# EAGLE design STM32F103C8T6 (EAGLE 9.4.2)
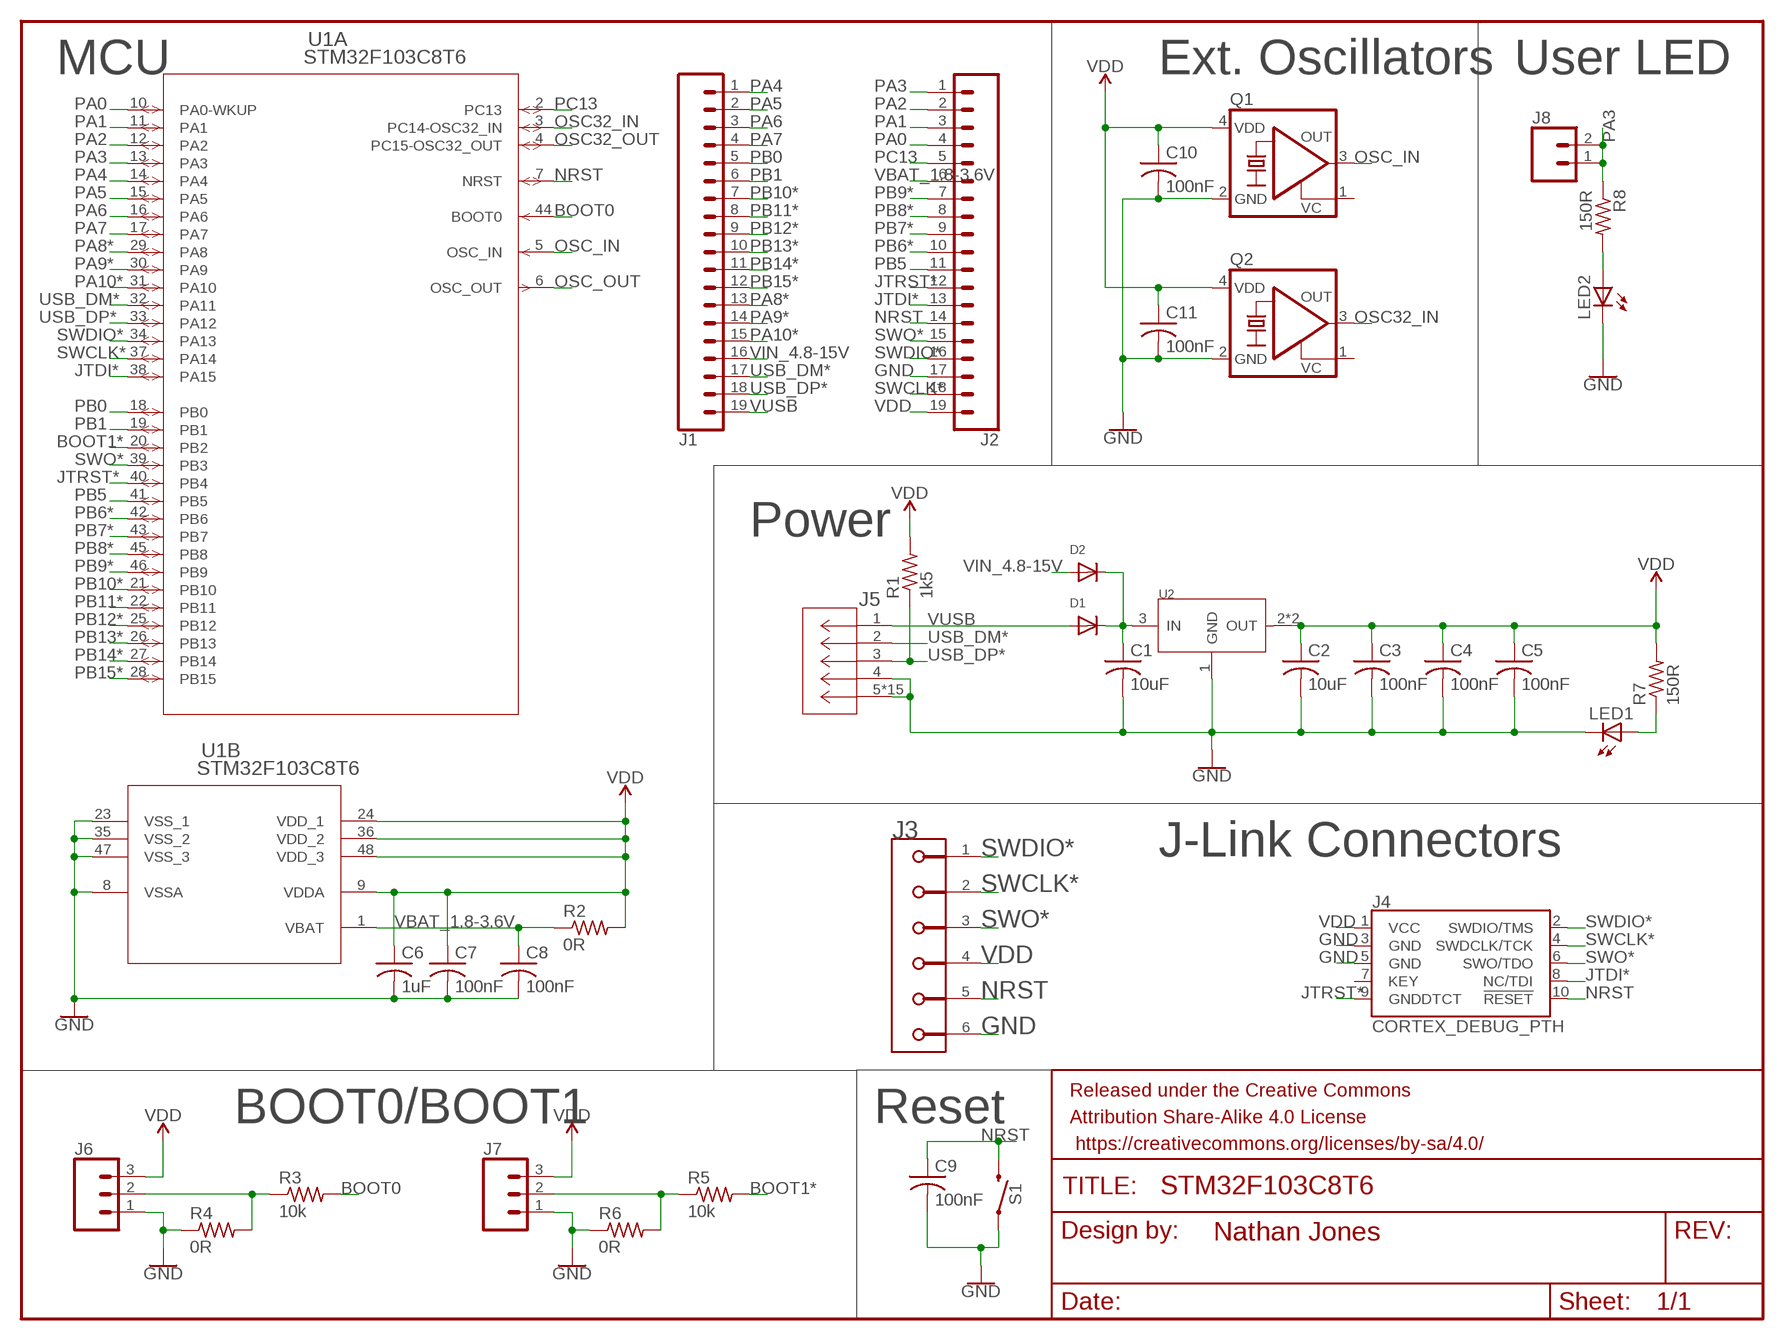
[diagram p0: schematic, sheet 1]

## Parts
C1  10uF  C-USC0402  [C0402]
C2  10uF  C-USC0402  [C0402]
C3  100nF  C-USC0402  [C0402]
C4  100nF  C-USC0402  [C0402]
C5  100nF  C-USC0402  [C0402]
C6  1uF  C-USC0402  [C0402]
C7  100nF  C-USC0402  [C0402]
C8  100nF  C-USC0402  [C0402]
C9  100nF  C-USC0402  [C0402]
C10  100nF  C-USC0402  [C0402]
C11  100nF  C-USC0402  [C0402]
D1  DIODESOD-123  [SOD-123]
D2  DIODESOD-123  [SOD-123]
FRAME2  FRAME-LETTERNO_PACKAGE  [DUMMY]
J1  CONN_191X19_NO_SILK  [1X19_NO_SILK]
J2  CONN_191X19_NO_SILK  [1X19_NO_SILK]
J3  AVX_6-PIN_009159006061916  [AVX_6-PIN_009159006061916_0]
J4  CORTEX_DEBUG_PTH  [2X5-PTH-1.27MM]
J5  10118194-0001LF  [CONN_10118194-0001LF_AMP]
J6  CONN_031X03_NO_SILK  [1X03_NO_SILK]
J7  CONN_031X03_NO_SILK  [1X03_NO_SILK]
J8  CONN_021X02_NO_SILK  [1X02_NO_SILK]
LED1  LEDCHIPLED_0603  [CHIPLED_0603]
LED2  LEDCHIPLED_0603  [CHIPLED_0603]
Q1  KXO-VCXO-CMOS_4  [3.2X2.5_KXO-84-TCXO]
Q2  KXO-VCXO-CMOS_4  [3.2X2.5_KXO-84-TCXO]
R1  1k5  R-US_R0402  [R0402]
R2  0R  R-US_R0402  [R0402]
R3  10k  R-US_R0402  [R0402]
R4  0R  R-US_R0402  [R0402]
R5  10k  R-US_R0402  [R0402]
R6  0R  R-US_R0402  [R0402]
R7  150R  R-US_R0402  [R0402]
R8  150R  R-US_R0402  [R0402]
S1  MOMENTARY-SWITCH-SPST-SMD-5.2-REDUNDANT  [TACTILE_SWITCH_SMD_5.2MM]
U1  STM32F103C8T6  [LQFP48-7X7MM]
U2  CJT1117-3.3-SOT223  PMIC-CJT1117-3.3(SOT223)  [SOT-223]

## Nets
BOOT0: R3.2 U1.44(A:BOOT0)
BOOT1*: R5.2 U1.20(A:PB2)
GND: C1.2 C2.2 C3.2 C4.2 C5.2 C6.2 C7.2 C8.2 C9.2 C10.2 C11.2 J2.17 J3.6 J4.3(GND) J4.5(GND) J5.4 J5.5 J5.10 J5.11 J5.S_1 J5.S_1_H1 J5.S_1_H2 J5.S_2 J5.S_2_H1 J5.S_2_H2 J5.S_3 J5.S_3_H1 J5.S_3_H2 J5.S_4 J5.S_4_H1 J5.S_4_H2 J6.1 J7.1 LED1.C LED2.C Q1.2(GND) Q2.2(GND) R4.1 R6.1 S1.1 S1.2 U1.8(B:VSSA) U1.23(B:VSS_1) U1.35(B:VSS_2) U1.47(B:VSS_3) U2.1(GND)
JTDI*: J2.13 J4.8(NC/TDI) U1.38(A:PA15)
JTRST*: J2.12 J4.9(GNDDTCT) U1.40(A:PB4)
N$1: J6.2 R3.1 R4.2
N$4: LED2.A R8.2
N$6: J7.2 R5.1 R6.2
N$7: LED1.A R7.1
NRST: C9.1 J2.14 J3.5 J4.10(!RESET) S1.3 S1.4 U1.7(A:NRST)
OSC32_IN: Q2.3(OUT) U1.3(A:PC14-OSC32_IN)
OSC32_OUT: U1.4(A:PC15-OSC32_OUT)
OSC_IN: Q1.3(OUT) U1.5(A:OSC_IN)
OSC_OUT: U1.6(A:OSC_OUT)
PA0: J2.4 U1.10(A:PA0-WKUP)
PA1: J2.3 U1.11(A:PA1)
PA2: J2.2 U1.12(A:PA2)
PA3: J2.1 J8.1 J8.2 R8.1 U1.13(A:PA3)
PA4: J1.1 U1.14(A:PA4)
PA5: J1.2 U1.15(A:PA5)
PA6: J1.3 U1.16(A:PA6)
PA7: J1.4 U1.17(A:PA7)
PA8*: J1.13 U1.29(A:PA8)
PA9*: J1.14 U1.30(A:PA9)
PA10*: J1.15 U1.31(A:PA10)
PB0: J1.5 U1.18(A:PB0)
PB1: J1.6 U1.19(A:PB1)
PB5: J2.11 U1.41(A:PB5)
PB6*: J2.10 U1.42(A:PB6)
PB7*: J2.9 U1.43(A:PB7)
PB8*: J2.8 U1.45(A:PB8)
PB9*: J2.7 U1.46(A:PB9)
PB10*: J1.7 U1.21(A:PB10)
PB11*: J1.8 U1.22(A:PB11)
PB12*: J1.9 U1.25(A:PB12)
PB13*: J1.10 U1.26(A:PB13)
PB14*: J1.11 U1.27(A:PB14)
PB15*: J1.12 U1.28(A:PB15)
PC13: J2.5 U1.2(A:PC13)
SWCLK*: J2.18 J3.2 J4.4(SWDCLK/TCK) U1.37(A:PA14)
SWDIO*: J2.16 J3.1 J4.2(SWDIO/TMS) U1.34(A:PA13)
SWO*: J2.15 J3.3 J4.6(SWO/TDO) U1.39(A:PB3)
USB_DM*: J1.17 J5.2 U1.32(A:PA11)
USB_DP*: J1.18 J5.3 R1.1 U1.33(A:PA12)
VBAT_1.8-3.6V: C8.1 J2.6 R2.1 U1.1(B:VBAT)
VDD: C2.1 C3.1 C4.1 C5.1 C6.1 C7.1 C10.1 C11.1 J2.19 J3.4 J4.1(VCC) J6.3 J7.3 Q1.4(VDD) Q2.4(VDD) R1.2 R2.2 R7.2 U1.9(B:VDDA) U1.24(B:VDD_1) U1.36(B:VDD_2) U1.48(B:VDD_3) U2.2(OUT) U2.TER(OUT)
VIN: C1.1 D1.C D2.C U2.3(IN)
VIN_4.8-15V: D2.A J1.16
VUSB: D1.A J1.19 J5.1
Unconnected: J4.7(KEY) Q1.1(VC) Q2.1(VC)

## Notes on the sheet
- MCU | Ext. Oscillators | User LED
- Power
- J-Link Connectors
- BOOT0/BOOT1 | Reset

## Library data of the parts
C1 C2 = adafruit:C-US: CAPACITOR, American symbol; LCSC_PART: C15525
C3-C5 C7-C11 = adafruit:C-US: CAPACITOR, American symbol; LCSC_PART: C1525
C6 = adafruit:C-US: CAPACITOR, American symbol; LCSC_PART: C52923
D1 D2 = adafruit:DIODE: Diode SMADIODE - SMA Surface Mount Package 20V 1A Schottky Diode Digikey: 641-1014-6-ND DO-1N4148 - Through Hole Small Current Diode SOD-123 20V 1 A (.5mV Vf) Schottky Diode - Digikey: MBRX120TPMSCT-ND SOD-323 10V 570mA (.38mV Vf, 3ns) Schottky Diode - Digikey: ZLLS410CT-ND SOD-523 30V 30mA Schottky Diode (RB751S-40TE61) - Digikey: RB751S-40TE61CT-ND SOT23-R/W - SOT23 Package (R = Solder Paste/Reflow Ovens, W = Hand-Soldering) BAT54Film 40V 300mA - Digikey: 497-7162-1-ND; LCSC_PART: C8598
FRAME2 = SparkFun-Aesthetics:FRAME-LETTER: Schematic Frame - Letter Standard 8.5x11 US Letter frame; DESIGNER: Nathan Jones; VERSION: v01
J1 J2 = SparkFun-Connectors:CONN_19: Multi connection point. Often used as Generic Header-pin footprint for 0.1 inch spaced/style header connections On any of the 0.1 inch spaced packages, you can populate with these: Break Away Headers - Straight <https://www.sparkfun.com/products/116> (PRT-00116) Break Away Male Headers - Right Angle <https://www.sparkfun.com/products/553> (PRT-00553) Female Headers <https://www.sparkfun.com/products/115> (PRT-00115) Break Away Headers - Machine Pin <https://www.sparkfun.com/products/117> (PRT-00117) Break Away Female Headers - Swiss Machine Pin <https://www.sparkfun.com/products/743> (PRT-00743) For SCREWTERMINALS and SPRING TERMINALS visit here: Screw Terimnals on SparkFun.com <https://www.sparkfun.com/search/results?term=Screw+Terminals> (5mm/3.5mm/2.54mm spacing) This device is also useful as a general connection point to wire up your design to another part of your project. Our various solder wires solder well into these plated through hole pads. Hook-Up Wire - Assortment (Stranded, 22 AWG) <https://www.sparkfun.com/products/11375> (PRT-11375) Hook-Up Wire - Assortment (Solid Core, 22 AWG) <https://www.sparkfun.com/products/11367> (PRT-11367) View the entire wire category on our website here <https://www.sparkfun.com/categories/141> Special notes: Molex polarized connector foot print use with SKU : PRT-08231 with associated crimp pins and housings. 1MM SMD Version SKU: PRT-10208 NOTES ON THE VARIANTS LOCK and LOCK_LONGPADS... This footprint was designed to help hold the alignment of a through-hole component (i.e. 6-pin header) while soldering it into place. You may notice that each hole has been shifted either up or down by 0.005 of an inch from it's more standard position (which is a perfectly straight line). This slight alteration caused the pins (the squares in the middle) to touch the edges of the holes. Because they are alternating, it causes a "brace" to hold the component in place. 0.005 has proven to be the perfect amount of "off-center" position when using our standard breakaway headers. Although looks a little odd when you look at the bare footprint, once you have a header in there, the alteration is very hard to notice. Also,if you push a header all the way into place, it is covered up entirely on the bottom side.
J3 = Debug-Edge_AVX-connectors:AVX_6-PIN_009159006061916
J4 = SparkFun-Connectors:CORTEX_DEBUG: Cortex Debug Connector - 10 pin Supports JTAG debug, Serial Wire debug, and Serial Wire Viewer. PTH and SMD connector options available. General Connector Information <http://infocenter.arm.com/help/topic/com.arm.doc.faqs/attached/13634/cortex_debug_connectors.pdf> Products: PTH Connector <http://www.digikey.com/product-detail/en/cnc-tech/3220-10-0100-00/1175-1627-ND/3883661> -via Digi-Key SparkFun PSoc <https://www.sparkfun.com/products/13229> SparkFun T <https://www.sparkfun.com/products/13810>
J5 = USB-micro-B_Amphenol_10118194-0001LF:10118194-0001LF; BUILT_BY: EMA_Cory; COPYRIGHT: Copyright (C) 2018 Accelerated Designs. All rights reserved; DATASHEET: https://www.amphenol-icc.com/media/wysiwyg/files/drawing/10118194.pdf; MANUFACTURER_PART_NUMBER: 10118194-0001LF; SOURCELIBRARY: Amphenol_ICC_2020-04-09; VENDOR: Amphenol
J6 J7 = SparkFun-Connectors:CONN_03: Multi connection point. Often used as Generic Header-pin footprint for 0.1 inch spaced/style header connections On any of the 0.1 inch spaced packages, you can populate with these: Break Away Headers - Straight <https://www.sparkfun.com/products/116> (PRT-00116) Break Away Male Headers - Right Angle <https://www.sparkfun.com/products/553> (PRT-00553) Female Headers <https://www.sparkfun.com/products/115> (PRT-00115) Break Away Headers - Machine Pin <https://www.sparkfun.com/products/117> (PRT-00117) Break Away Female Headers - Swiss Machine Pin <https://www.sparkfun.com/products/743> (PRT-00743) Stackable Header - 3 Pin (Female, 0.1") <https://www.sparkfun.com/products/13875> (PRT-13875) For SCREWTERMINALS and SPRING TERMINALS visit here: Screw Terimnals on SparkFun.com <https://www.sparkfun.com/search/results?term=Screw+Terminals> (5mm/3.5mm/2.54mm spacing) This device is also useful as a general connection point to wire up your design to another part of your project. Our various solder wires solder well into these plated through hole pads. Hook-Up Wire - Assortment (Stranded, 22 AWG) <https://www.sparkfun.com/products/11375> (PRT-11375) Hook-Up Wire - Assortment (Solid Core, 22 AWG) <https://www.sparkfun.com/products/11367> (PRT-11367) View the entire wire category on our website here <https://www.sparkfun.com/categories/141> Special notes: Molex polarized connector foot print use with SKU : PRT-08232 with associated crimp pins and housings.
J8 = SparkFun-Connectors:CONN_02: Multi connection point. Often used as Generic Header-pin footprint for 0.1 inch spaced/style header connections On any of the 0.1 inch spaced packages, you can populate with these: Break Away Headers - Straight <https://www.sparkfun.com/products/116> (PRT-00116) Break Away Male Headers - Right Angle <https://www.sparkfun.com/products/553> (PRT-00553) Female Headers <https://www.sparkfun.com/products/115> (PRT-00115) Break Away Headers - Machine Pin <https://www.sparkfun.com/products/117> (PRT-00117) Break Away Female Headers - Swiss Machine Pin <https://www.sparkfun.com/products/743> (PRT-00743) For SCREWTERMINALS and SPRING TERMINALS visit here: Screw Terimnals on SparkFun.com <https://www.sparkfun.com/search/results?term=Screw+Terminals> (5mm/3.5mm/2.54mm spacing) This device is also useful as a general connection point to wire up your design to another part of your project. Our various solder wires solder well into these plated through hole pads. Hook-Up Wire - Assortment (Stranded, 22 AWG) <https://www.sparkfun.com/products/11375> (PRT-11375) Hook-Up Wire - Assortment (Solid Core, 22 AWG) <https://www.sparkfun.com/products/11367> (PRT-11367) View the entire wire category on our website here <https://www.sparkfun.com/categories/141> Special notes: Molex polarized connector foot print use with: PRT-08233 with associated crimp pins and housings. 2.54_SCREWTERM for use with PRT-10571. 3.5mm Screw Terminal footprints for PRT-08084 5mm Screw Terminal footprints for use with PRT-08432
LED1 = adafruit:LED: LED OSRAM: - CHIPLED LG R971, LG N971, LY N971, LG Q971, LY Q971, LO R971, LY R971 LH N974, LH R974 LS Q976, LO Q976, LY Q976 LO Q996 - Hyper CHIPLED LW Q18S LB Q993, LB Q99A, LB R99A - SideLED LS A670, LO A670, LY A670, LG A670, LP A670 LB A673, LV A673, LT A673, LW A673 LH A674 LY A675 LS A676, LA A676, LO A676, LY A676, LW A676 LS A679, LY A679, LG A679 - Hyper Micro SIDELED® LS Y876, LA Y876, LO Y876, LY Y876 LT Y87S - SmartLED LW L88C, LW L88S LB L89C, LB L89S, LG L890 LS L89K, LO L89K, LY L89K LS L896, LA L896, LO L896, LY L896 - TOPLED LS T670, LO T670, LY T670, LG T670, LP T670 LSG T670, LSP T670, LSY T670, LOP T670, LYG T670 LG T671, LOG T671, LSG T671 LB T673, LV T673, LT T673, LW T673 LH T674 LS T676, LA T676, LO T676, LY T676, LB T676, LH T676, LSB T676, LW T676 LB T67C, LV T67C, LT T67C, LS T67K, LO T67K, LY T67K, LW E67C LS E67B, LA E67B, LO E67B, LY E67B, LB E67C, LV E67C, LT E67C LW T67C LS T679, LY T679, LG T679 LS T770, LO T770, LY T770, LG T770, LP T770 LB T773, LV T773, LT T773, LW T773 LH T774 LS E675, LA E675, LY E675, LS T675 LS T776, LA T776, LO T776, LY T776, LB T776 LHGB T686 LT T68C, LB T68C - Hyper Mini TOPLED® LB M676 - Mini TOPLED Santana® LG M470 LS M47K, LO M47K, LY M47K Source: http://www.osram.convergy.de/; LCSC_PART: C72041
LED2 = adafruit:LED: LED OSRAM: - CHIPLED LG R971, LG N971, LY N971, LG Q971, LY Q971, LO R971, LY R971 LH N974, LH R974 LS Q976, LO Q976, LY Q976 LO Q996 - Hyper CHIPLED LW Q18S LB Q993, LB Q99A, LB R99A - SideLED LS A670, LO A670, LY A670, LG A670, LP A670 LB A673, LV A673, LT A673, LW A673 LH A674 LY A675 LS A676, LA A676, LO A676, LY A676, LW A676 LS A679, LY A679, LG A679 - Hyper Micro SIDELED® LS Y876, LA Y876, LO Y876, LY Y876 LT Y87S - SmartLED LW L88C, LW L88S LB L89C, LB L89S, LG L890 LS L89K, LO L89K, LY L89K LS L896, LA L896, LO L896, LY L896 - TOPLED LS T670, LO T670, LY T670, LG T670, LP T670 LSG T670, LSP T670, LSY T670, LOP T670, LYG T670 LG T671, LOG T671, LSG T671 LB T673, LV T673, LT T673, LW T673 LH T674 LS T676, LA T676, LO T676, LY T676, LB T676, LH T676, LSB T676, LW T676 LB T67C, LV T67C, LT T67C, LS T67K, LO T67K, LY T67K, LW E67C LS E67B, LA E67B, LO E67B, LY E67B, LB E67C, LV E67C, LT E67C LW T67C LS T679, LY T679, LG T679 LS T770, LO T770, LY T770, LG T770, LP T770 LB T773, LV T773, LT T773, LW T773 LH T774 LS E675, LA E675, LY E675, LS T675 LS T776, LA T776, LO T776, LY T776, LB T776 LHGB T686 LT T68C, LB T68C - Hyper Mini TOPLED® LB M676 - Mini TOPLED Santana® LG M470 LS M47K, LO M47K, LY M47K Source: http://www.osram.convergy.de/; LCSC_PART: C72038
Q1 = crystal-geyer_V1_0:KXO-VCXO-CMOS_4: VCXO : CMOS - Serie Model Size l/w/h [mm] Frequency Range Frequency Stability Temp. Range [°C] Output AECQ 200 availabel Datasheet KXO-84 3.2/2.5/1.0 1.25 ~ 54.0 MHz ±10 … ±50ppm (*) -40°C …+85°C CMOS - KXO-84.pdf <http://www.geyer-electronic.de/uploads/tx_userartikelfrequenz/GEYER-KXO-84-VCXO-CMOS.pdf> <http://www.geyer-electronic.de/fileadmin/template/img/logo-geyer-electronic.png> Details see: http://www.geyer-electronic.de/Frequenz-Produkte.9.0.html Created 2016-06-07, Hans Locher 2016 (C) Geyer Quartz Technology KX84;3,2x2,5;3.2x2.5;3225; LCSC_PART: C39097
Q2 = crystal-geyer_V1_0:KXO-VCXO-CMOS_4: VCXO : CMOS - Serie Model Size l/w/h [mm] Frequency Range Frequency Stability Temp. Range [°C] Output AECQ 200 availabel Datasheet KXO-84 3.2/2.5/1.0 1.25 ~ 54.0 MHz ±10 … ±50ppm (*) -40°C …+85°C CMOS - KXO-84.pdf <http://www.geyer-electronic.de/uploads/tx_userartikelfrequenz/GEYER-KXO-84-VCXO-CMOS.pdf> <http://www.geyer-electronic.de/fileadmin/template/img/logo-geyer-electronic.png> Details see: http://www.geyer-electronic.de/Frequenz-Produkte.9.0.html Created 2016-06-07, Hans Locher 2016 (C) Geyer Quartz Technology KX84;3,2x2,5;3.2x2.5;3225; LCSC_PART: C387415
R1 = adafruit:R-US_: RESISTOR, American symbol; LCSC_PART: C25867
R2 R4 R6 = adafruit:R-US_: RESISTOR, American symbol; LCSC_PART: C17168
R3 R5 = adafruit:R-US_: RESISTOR, American symbol; LCSC_PART: C25744
R7 R8 = adafruit:R-US_: RESISTOR, American symbol; LCSC_PART: C25082
S1 = SparkFun-Switches:MOMENTARY-SWITCH-SPST: Momentary Switch (Pushbutton) - SPST Normally-open (NO) SPST momentary switches (buttons, pushbuttons). Variants PTH-12MM - 12mm square, through-hole Momentary Pushbutton Switch - 12mm Square <https://www.sparkfun.com/products/9190> (COM-09190) PTH-6.0MM, PTH-6.0MM-KIT - 6.0mm square, through-hole Mini Pushbutton Switch <https://www.sparkfun.com/products/97> (COM-00097) KIT package intended for soldering kit's - only one side of pads' copper is exposed. PTH-RIGHT-ANGLE-KIT - Right-angle, through-hole Right Angle Tactile Button <https://www.sparkfun.com/products/10791> - Used on SparkFun BigTime Watch Kit <https://www.sparkfun.com/products/11734> SMD-12MM - 12mm square, surface-mount Tactile Button - SMD (12mm) <https://www.sparkfun.com/products/12993> (COM-12993) Used on SparkFun PicoBoard <https://www.sparkfun.com/products/11888> SMD-4.5MM - 4.5mm Square Trackball Switch Used on SparkFun Blackberry Trackballer Breakout <https://www.sparkfun.com/products/13169> SMD-4.6MMX2.8MM - 4.60mm x 2.80mm, surface mount Used on SparkFun SAMD21 Mini Breakout <https://www.sparkfun.com/products/13664> SMD-5.2MM, SMD-5.2-REDUNDANT - 5.2mm square, surface-mount Mini Pushbutton Switch - SMD <https://www.sparkfun.com/products/8720> (COM-08720) Used on Arduino Pro Mini <https://www.sparkfun.com/products/11114> REDUNDANT package connects both switch circuits together SMD-6.0X3.5MM - 6.0 x 3.5mm, surface mount Momentary Reset Switch SMD <https://www.sparkfun.com/products/8229> (COM-08229) SMD-6.2MM-TALL - 6.2mm square, surface mount Tactile Button - SMD (6mm) <https://www.sparkfun.com/products/12992> Used on SparkFun Digital Sandbox <https://www.sparkfun.com/products/12651> SMD-RIGHT-ANGLE - Right-angle, surface mount Used on SparkFun Block for Intel® Edison - Arduino <https://www.sparkfun.com/products/13036>; LCSC_PART: C318884; PROD_ID: SWCH-08247; SF_SKU: COM-08720
U1 = STM32F103C8T6:STM32F103C8T6; BUILT_BY: EMA_UL_Team; COPYRIGHT: Copyright (C) 2018 Accelerated Designs. All rights reserved; LCSC_PART: C94046; MANUFACTURER_PART_NUMBER: STM32F103C8T6; SOURCELIBRARY: Updates_to_database_2020-10-19; VENDOR: STMicroelectronics
U2 = OPL_IC:PMIC-CJT1117-3.3(SOT223): 310030097; LCSC_PART: C6186; MPN: CJT1117-3.3

## Board
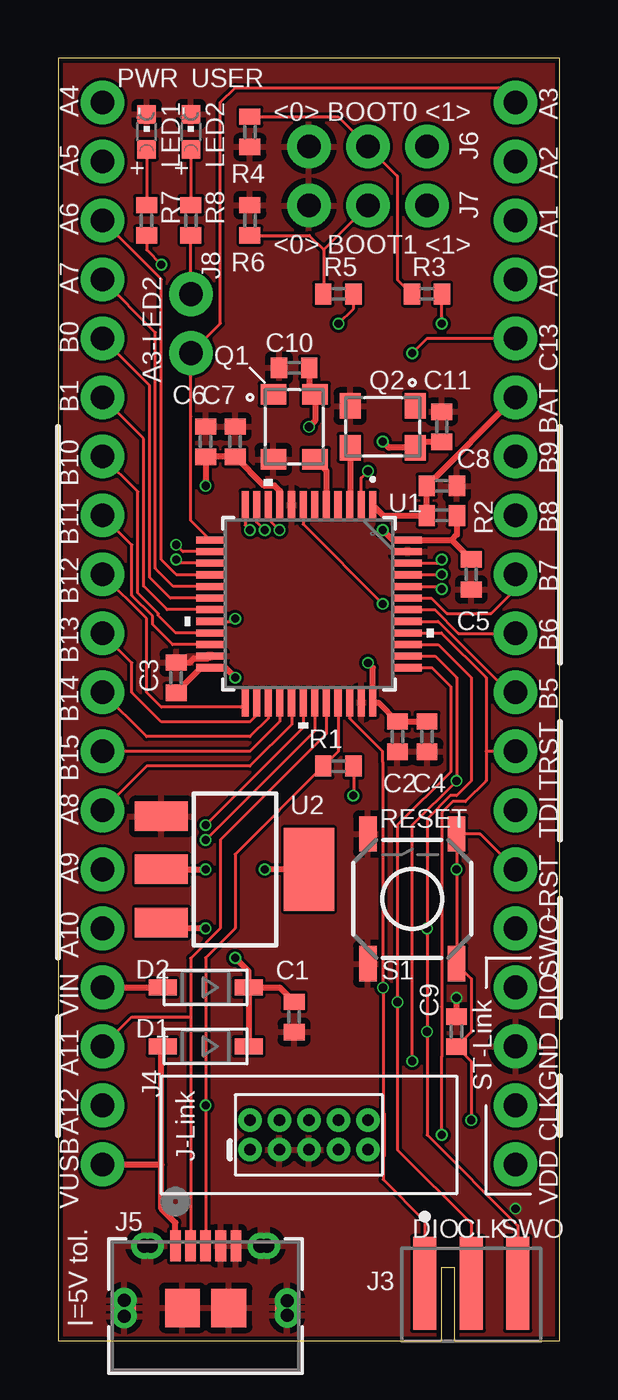
[diagram p1: board, top side]
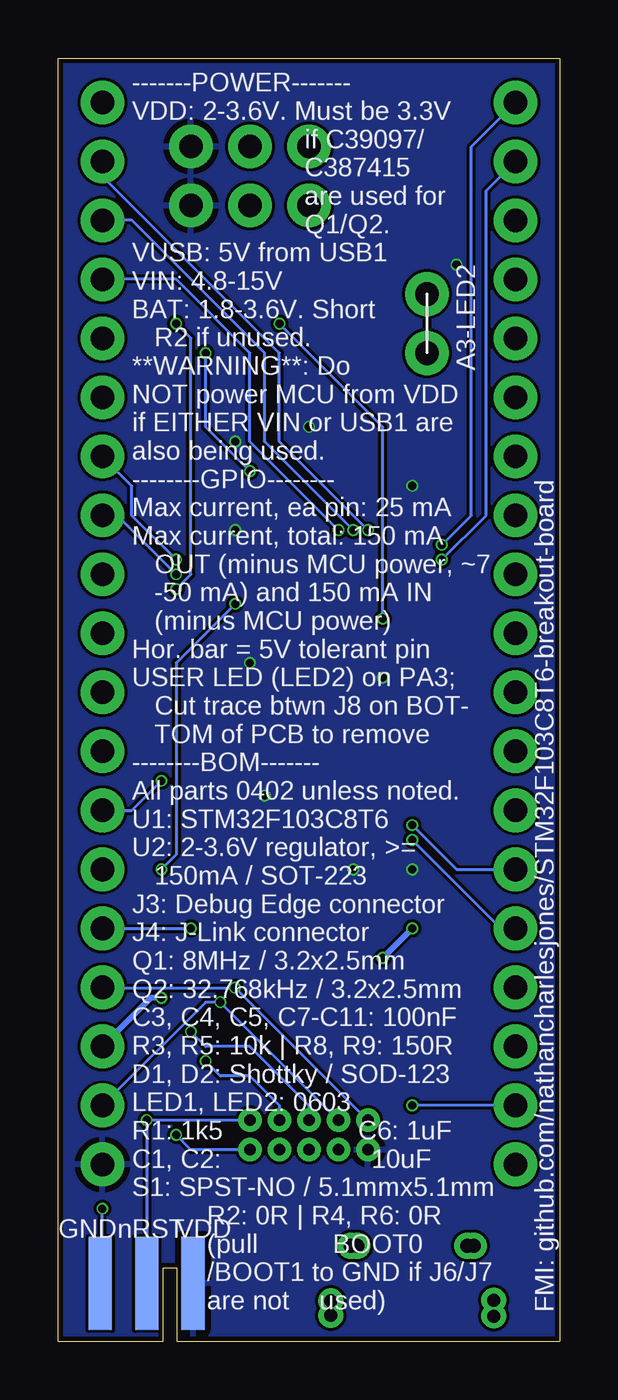
[diagram p2: board, bottom side, seen from below]

Size 21.59 x 55.24 mm. Coordinates in mm from the lower left corner, seen from the top.
Outline: 21.59,0 21.59,55.24 0,55.24 0,0 16.48,0 16.48,3.17 17.07,3.17 17.07,0 21.59,0
Copper layers (1*16): Top 0.035mm / dielectric 1.6mm / Bottom 0.035mm
Design rules "jlcpcb-2layers": minimum track width 5mil, minimum drill 0.3mm, track to track 5mil, track to pad 5mil, pad to pad 5mil, via to via 5mil, smd to smd 5mil, copper to edge 0.2mm, drill to drill 6mil, minimum pad ring 10mil, minimum via ring 3mil, stop-mask expansion 4mil, vias tented up to drill 0mil, thermal gap 10mil

### Footprints (pad centres in the part's own frame; a part is rotated, then mirrored left to right if it is on the bottom)
C0402 = smd 0.7 x 0.9: 1 -0.65,0; 2 0.65,0
SOD-123 = smd 1.2 x 0.7: A 1.85,0; C -1.85,0
1X19_NO_SILK = drill 1.016 pad 1.88: 1 0,0; 2 2.54,0; 3 5.08,0; 4 7.62,0; 5 10.16,0; 6 12.7,0; 7 15.24,0; 8 17.78,0; 9 20.32,0; 10 22.86,0; 11 25.4,0; 12 27.94,0; 13 30.48,0; 14 33.02,0; 15 35.56,0; 16 38.1,0; 17 40.64,0; 18 43.18,0; 19 45.72,0
AVX_6-PIN_009159006061916_0 = smd 1 x 4: 1 -2,2.5; 2 0,2.5; 3 2,2.5 | smd 1 x 4 bottom: 4 -2,2.5; 5 0,2.5; 6 2,2.5
2X5-PTH-1.27MM = drill 0.508 pad 1: 1 -2.54,-0.635; 2 -2.54,0.635; 3 -1.27,-0.635; 4 -1.27,0.635; 5 0,-0.635; 6 0,0.635; 7 1.27,-0.635; 8 1.27,0.635; 9 2.54,-0.635; 10 2.54,0.635
CONN_10118194-0001LF_AMP = smd 0.457 x 1.346: 1 -1.3,2.594; 2 -0.65,2.594; 3 0,2.594; 4 0.65,2.594; 5 1.3,2.594 | smd 1.499 x 1.651: 10 -1,-0.081; 11 1,-0.081 | smd 1.016 x 1.702: S_1 -3.5,-0.081 | drill 0.559 pad 0.559: S_1_H1 -3.505,0.254; S_1_H2 -3.505,-0.432; S_2_H1 3.505,0.229; S_2_H2 3.505,-0.406 | smd 1.016 x 1.651: S_2 3.5,-0.081 | smd 1.295 x 1.016: S_3 -2.5,2.594; S_4 2.5,2.594 | drill 0.61 pad 0.61: S_3_H1 -2.362,2.591; S_3_H2 -2.642,2.591; S_4_H1 2.642,2.591; S_4_H2 2.362,2.591
1X03_NO_SILK = drill 1.016 pad 1.88: 1 0,0; 2 2.54,0; 3 5.08,0
1X02_NO_SILK = drill 1.016 pad 1.88: 1 0,0; 2 2.54,0
CHIPLED_0603 = smd 0.8 x 0.8: A 0,-0.75; C 0,0.75
3.2X2.5_KXO-84-TCXO = smd 0.9 x 1.1: 1 -1.4,-0.9; 2 1.4,-0.9; 3 1.4,0.9; 4 -1.4,0.9
R0402 = smd 0.7 x 0.9: 1 -0.65,0; 2 0.65,0
TACTILE_SWITCH_SMD_5.2MM = smd 1.524 x 0.762: 1 -2.794,1.905; 2 2.794,1.905; 3 -2.794,-1.905; 4 2.794,-1.905
LQFP48-7X7MM = smd 1.194 x 0.305: 1 -4.25,2.75; 2 -4.25,2.25; 3 -4.25,1.75; 4 -4.25,1.25; 5 -4.25,0.75; 6 -4.25,0.25; 7 -4.25,-0.25; 8 -4.25,-0.75; 9 -4.25,-1.25; 10 -4.25,-1.75; 11 -4.25,-2.25; 12 -4.25,-2.75; 25 4.25,-2.75; 26 4.25,-2.25; 27 4.25,-1.75; 28 4.25,-1.25; 29 4.25,-0.75; 30 4.25,-0.25; 31 4.25,0.25; 32 4.25,0.75; 33 4.25,1.25; 34 4.25,1.75; 35 4.25,2.25; 36 4.25,2.75 | smd 0.305 x 1.194: 13 -2.75,-4.25; 14 -2.25,-4.25; 15 -1.75,-4.25; 16 -1.25,-4.25; 17 -0.75,-4.25; 18 -0.25,-4.25; 19 0.25,-4.25; 20 0.75,-4.25; 21 1.25,-4.25; 22 1.75,-4.25; 23 2.25,-4.25; 24 2.75,-4.25; 37 2.75,4.25; 38 2.25,4.25; 39 1.75,4.25; 40 1.25,4.25; 41 0.75,4.25; 42 0.25,4.25; 43 -0.25,4.25; 44 -0.75,4.25; 45 -1.25,4.25; 46 -1.75,4.25; 47 -2.25,4.25; 48 -2.75,4.25
SOT-223 = smd 1.27 x 2.286: 1 -2.286,-3.175; 2 0,-3.175; 3 2.286,-3.175 | smd 3.556 x 2.159: TER 0,3.175

### Placement (x,y rotation side)
C1  10.16,13.97 270 top
C2  14.61,26.04 270 top
C3  5.08,28.57 90 top
C4  15.88,26.04 270 top
C5  17.78,33.02 270 top
C6  6.35,38.73 90 top
C7  7.62,38.73 90 top
C8  16.51,36.83 0 top
C9  17.14,13.34 90 top
C10  10.16,41.91 180 top
C11  16.51,39.37 90 top
D1  6.35,12.7 180 top
D2  6.35,15.24 180 top
FRAME2  -10.79,0 0 top  (outside the outline)
J1  1.91,53.34 270 top
J2  19.68,53.34 270 top
J3  17.78,0 0 top
J4  10.79,8.89 0 top
J5  6.35,1.52 0 top
J6  10.79,51.44 0 top
J7  10.79,48.9 0 top
J8  5.71,42.55 90 top
LED1  3.81,52.07 0 top
LED2  5.71,52.07 0 top
Q1  10.16,39.37 270 top
Q2  13.97,39.37 180 top
R1  12.06,24.77 0 top
R2  16.51,35.56 0 top
R3  15.88,45.09 0 top
R4  8.26,52.07 90 top
R5  12.06,45.09 0 top
R6  8.26,48.26 270 top
R7  3.81,48.26 270 top
R8  5.71,48.26 90 top
S1  15.24,19.05 90 top
U1  10.79,31.75 270 top
U2  7.62,20.32 270 top

### Tracks (layer width: path | path; a pad name or v marks a point on that pad's centre or on a via)
BOOT0  (via drill 0.35)
  Top 0.127: U1.44 16.39,32.5 v16.51,32.38 | v16.51,43.81 16.51,45.07 R3.2
  Bottom 0.127: v16.51,32.38 15.88,33.02 15.88,43.18 v16.51,43.81
BOOT1*  (via drill 0.35)
  Top 0.127: U1.20 7.5,31 v7.62,31.11 | R5.2 12.71,44.47 v12.06,43.81
  Bottom 0.127: v12.06,43.81 7.62,39.37 v7.62,31.11
GND  (via drill 0.35)
  Top 0.254: U1.23 6.45,29.41 5.84,29.41 5.66,29.23 C3.2 | C9.2 v17.14,14.79
  Bottom 0.127: J3.6 19.68,2.6 v19.68,5.71
  Bottom 0.254: v17.14,14.79 17.6,14.79 J2.17
  pour Top: 0,55.24 21.59,55.24 21.59,0 0,0
JTDI*  (via drill 0.35)
  Top 0.127: U1.38 16.22,29.5 17.14,28.57 v17.14,24.13 15.24,22.23 v15.24,12.06
  Bottom 0.127: J4.8 12.06,10.16 13.34,11.43 14.61,11.43 v15.24,12.06 | J2.13 18.41,22.86 v17.14,24.13
JTRST*  (via drill 0.35)
  Top 0.127: U1.40 16.49,30.5 18.41,28.57 18.41,25.4 | 18.41,25.4 18.41,24.13 17.53,23.24 16.97,23.24 16.51,22.78 16.51,14.42 16.5,14.41 16.5,12.26 16.51,12.25 v16.51,8.89 | J2.12 18.41,25.4
  Bottom 0.127: J4.9 15.88,8.26 v16.51,8.89
N$1
  Top 0.127: R4.2 12.05,52.72 J6.2 14.61,50.16 14.61,45.7 R3.1
N$4
  Top 0.127: LED2.A R8.2
N$6
  Top 0.127: R6.2 10.81,47.61 11.43,46.99 | 11.43,46.99 11.43,45.1 R5.1 | J7.2 11.43,46.99
N$7
  Top 0.127: LED1.A R7.1
NRST  (via drill 0.35)
  Top 0.127: J2.14 18.16,21.84 S1.4 v17.14,20.32 S1.3 17.79,15.62 17.79,13.56 17.78,13.55 17.78,13.32 C9.1 17.78,12.05 v17.78,9.53 | U1.7 10.54,35.17 v13.97,31.75
  Bottom 0.127: J4.10 v17.78,9.53 J3.5 | v13.97,31.75 16.51,29.21 16.51,20.95 v17.14,20.32
OSC32_IN
  Top 0.254: Q2.3 12.57,36.02 U1.3
OSC_IN
  Top 0.254: Q1.3 11.54,37.48 U1.5
PA0  (via drill 0.35)
  Top 0.127: U1.10 9.04,35.41 v9.53,34.92
  Bottom 0.127: v9.53,34.92 13.34,38.73 13.34,42.55 16.51,45.72 J2.4
PA1  (via drill 0.35)
  Top 0.127: U1.11 8.54,35.27 v8.89,34.92
  Bottom 0.127: v8.89,34.92 12.7,38.73 12.7,42.55 18.41,48.26 J2.3
PA2  (via drill 0.35)
  Top 0.127: U1.12 8.04,35.13 v8.26,34.92
  Bottom 0.127: v8.26,34.92 12.06,38.73 12.06,42.55 19.68,50.16 J2.2
PA3
  Top 0.127: U1.13 5.71,35.34 5.71,39.81 5.71,39.82 J8.1 6.99,43.81 6.99,53.34 7.62,53.98 19.05,53.98 J2.1 | J8.2 R8.1
  Bottom 0.127: J8.1 J8.2
PA4  (via drill 0.35)
  Top 0.127: U1.14 5.37,34 v5.08,34.29
  Bottom 0.127: v5.08,34.29 3.81,35.56 3.81,51.44 J1.1
PA5  (via drill 0.35)
  Top 0.127: U1.15 5.24,33.5 v5.08,33.66
  Bottom 0.127: v5.08,33.66 3.17,35.56 3.17,49.53 J1.2
PA6
  Top 0.127: U1.16 5.1,33 4.45,33.66 4.45,45.72 J1.3
PA7
  Top 0.127: U1.17 4.96,32.5 4.19,33.27 4.19,43.43 J1.4
PA8*
  Top 0.127: U1.29 10.04,26.55 8.26,24.77 3.81,24.77 J1.13
PA9*  (via drill 0.35)
  Top 0.127: U1.30 10.54,26.42 v6.35,22.23
  Bottom 0.127: v6.35,22.23 4.45,20.32 J1.14
PA10*  (via drill 0.35)
  Top 0.127: U1.31 11.04,26.29 v6.35,21.59
  Bottom 0.127: v6.35,21.59 2.54,17.78 J1.15
PB0
  Top 0.127: U1.18 4.83,32 3.94,32.89 3.94,41.15 J1.5
PB1
  Top 0.127: U1.19 4.7,31.5 3.68,32.51 3.68,38.86 J1.6
PB5
  Top 0.127: U1.41 16.35,31 19.41,27.94 J2.11
PB6*
  Top 0.127: U1.42 16.21,31.5 17.23,30.48 J2.10
PB7*
  Top 0.127: U1.43 16.07,32 16.73,31.34 17.78,31.34 18,31.34 18.64,31.34 19.68,32.38 J2.9
PB8*  (via drill 0.35)
  Top 0.127: U1.45 15.06,33.02 v16.51,33.02
  Bottom 0.127: v16.51,33.02 19.05,35.56 J2.8
PB9*  (via drill 0.35)
  Top 0.127: U1.46 16.36,33.5 v16.51,33.66
  Bottom 0.127: v16.51,33.66 18.41,35.56 18.41,36.83 J2.7
PB10*
  Top 0.127: U1.21 5.06,30.5 4.32,31.24 4.32,31.32 3.43,32.21 3.43,36.58 J1.7
PB11*
  Top 0.127: U1.22 4.92,30 4.06,30.86 4.06,31.22 3.17,32.11 3.17,34.29 J1.8
PB12*
  Top 0.127: U1.25 7.85,27.3 4.45,27.3 3.81,27.94 3.81,31.11 J1.9
PB13*
  Top 0.127: U1.26 8.54,26.96 8.26,26.67 4.45,26.67 3.17,27.94 3.17,29.21 J1.10
PB14*
  Top 0.127: U1.27 9.04,26.82 8.26,26.04 3.81,26.04 J1.11
PB15*
  Top 0.127: U1.28 9.54,26.69 8.26,25.4 J1.12
PC13  (via drill 0.35)
  Top 0.127: U1.2 13.04,37.17 v13.34,37.47 | v15.24,42.55 15.88,43.18 J2.5
  Bottom 0.127: v13.34,37.47 15.24,39.37 v15.24,42.55
SWCLK*  (via drill 0.35)
  Top 0.127: U1.37 16.09,29 16.89,28.19 16.89,24.51 14.61,22.23 v14.61,14.61 14.61,8.26 17.78,5.08 J3.2
  Bottom 0.127: J2.18 15.24,14.61 v14.61,14.61 J4.4
SWDIO*  (via drill 0.35)
  Top 0.127: U1.34 12.54,26.82 13.96,25.41 13.96,24.96 13.98,24.94 v13.98,15.23 13.98,9.86 14.03,9.81 14.03,7.97 13.98,7.92 13.98,6.97 15.78,5.17 J3.1
  Bottom 0.127: J2.16 19.67,15.23 v13.98,15.23 13.96,15.23 J4.2
SWO*  (via drill 0.35)
  Top 0.127: U1.39 16.36,30 17.78,28.57 17.78,24.13 17.14,23.5 16.87,23.5 15.88,22.5 v15.88,17.78 v15.88,13.34 15.88,8.89 19.78,4.99 J3.3
  Bottom 0.127: J4.6 10.79,10.16 13.34,12.7 15.24,12.7 v15.88,13.34 | J2.15 v15.88,17.78
USB_DM*
  Top 0.127: U1.32 11.54,26.15 6.99,21.59 6.99,17.78 5.7,16.5 5.7,13.97 | 5.7,13.97 J5.2 | J1.17 3.17,13.97 5.7,13.97
USB_DP*  (via drill 0.35)
  Top 0.127: U1.33 12.04,25.39 R1.1 7.62,20.97 7.62,17.78 6.35,16.51 v6.35,10.16 J5.3
  Bottom 0.127: J1.18 v6.35,10.16
VBAT_1.8-3.6V
  Top 0.254: U1.1 13.98,35.56 R2.1 C8.1 J2.6
VDD  (via drill 0.35)
  Top 0.127: R1.2 12.71,23.51 v12.7,23.5 | R7.2 3.81,46.99 v4.45,46.35
  Top 0.254: C10.1 10.81,41.02 Q1.4 11.06,39.63 v10.79,39.37 | C11.1 15.62,38.72 Q2.4 14.23,38.47 v13.97,38.73 | v13.97,34.92 14.39,34.5 U1.48 16.93,34.5 | C4.1 C2.1 13.79,27.5 U1.36 13.54,29 v13.34,29.21 | v7.62,28.57 7.2,29 U1.24 6.16,29 C3.1 | U2.2 v6.35,20.32 | U2.TER v8.89,20.32 | C5.1 17.77,33.67 16.93,34.5 | R2.2 17.16,34.73 16.93,34.5 | v6.35,36.83 C6.1 C7.1 8.85,36.85 9.3,36.85 9.54,36.61 U1.9
  pour Bottom: 0,55.24 21.59,55.24 21.59,0 0,0
VIN  (via drill 0.35)
  Top 0.254: D2.C D1.C | D2.C 9.54,15.24 C1.1 | D2.C 8.2,15.93 v7.62,16.51 | v6.35,17.78 4.7,17.78 U2.3
  Bottom 0.254: v7.62,16.51 v6.35,17.78
VIN_4.8-15V
  Top 0.254: J1.16 D2.A
VUSB
  Top 0.254: J5.1 5.05,5.11 4.45,5.71 4.45,7.62 | 4.45,7.62 4.45,12.64 D1.A | J1.19 4.45,7.62

### Text on the board
tPlace: ST-Link
tNames: PWR | USER | A3 | A4 | <0> BOOT0 <1> | A2 | A5 | + - | + - | A1 | A6 | <0> BOOT1 <1> | A0 | A7 | C13 | B0 | A3-LED2 | BAT | B1 | B9 | B10 | B8 | B11 | B7 | B12 | B6 | B13 | B5 | B14 | TRST | B15 | TDI | A8 | RESET | ~RST | A9 | SWO | A10 | DIO | VIN | GND | A11 | J-Link | CLK | A12 | VDD | VUSB | DIO | CLK | SWO | |=5V tol.
bNames: -------POWER------- / VDD: 2-3.6V. Must be 3.3V / if C39097/ / C387415 / are used for / Q1/Q2. / VUSB: 5V from USB1 / VIN: 4.8-15V / BAT: 1.8-3.6V. Short / R2 if unused. / **WARNING**: Do / NOT power MCU from VDD / if EITHER VIN or USB1 are / also being used. / --------GPIO-------- / Max current, ea pin: 25 mA / Max current, total: 150 mA / OUT (minus MCU power, ~7 / -50 mA) and 150 mA IN / (minus MCU power) / Hor. bar = 5V tolerant pin / USER LED (LED2) on PA3; / Cut trace btwn J8 on BOT- / TOM of PCB to remove / --------BOM------- / All parts 0402 unless noted. / U1: STM32F103C8T6 / U2: 2-3.6V regulator, >= / 150mA / SOT-223 / J3: Debug Edge connector / J4: J-Link connector / Q1: 8MHz / 3.2x2.5mm / Q2: 32.768kHz / 3.2x2.5mm / C3, C4, C5, C7-C11: 100nF / R3, R5: 10k | R8, R9: 150R / D1, D2: Shottky / SOD-123 / LED1, LED2: 0603 / R1: 1k5 C6: 1uF / C1, C2: 10uF / S1: SPST-NO / 5.1mmx5.1mm / R2: 0R | R4, R6: 0R / (pull BOOT0 / /BOOT1 to GND if J6/J7 / are not used) | A3-LED2 | VDD | nRST | GND | FMI: github.com/nathancharlesjones/STM32F103C8T6-breakout-board